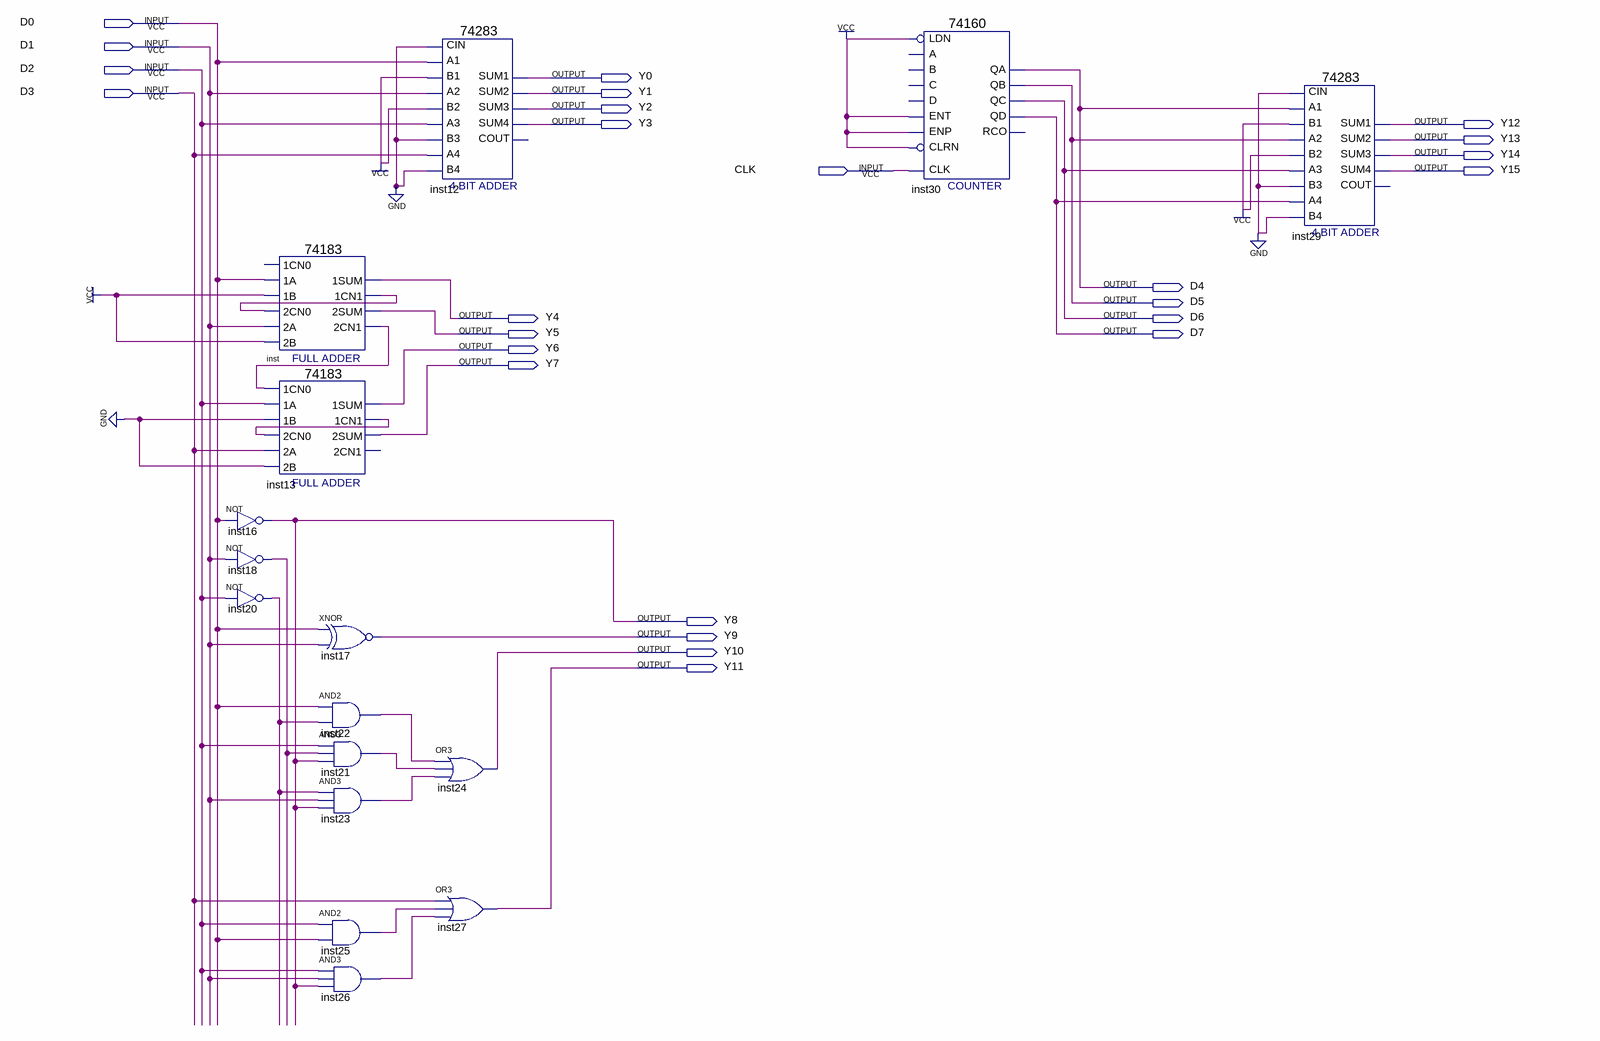
[diagram p0: schematic sheet]
// Quartus schematic lab2.bdf as structural Verilog: 16 symbols, 25 pins
module lab2 (
  input  D0,
  input  D1,
  input  D2,
  input  D3,
  input  CLK,
  output Y0,
  output Y1,
  output Y2,
  output Y3,
  output Y12,
  output Y13,
  output Y14,
  output Y15,
  output D4,
  output D5,
  output Y4,
  output D6,
  output Y5,
  output D7,
  output Y6,
  output Y7,
  output Y8,
  output Y9,
  output Y10,
  output Y11
);

  wire inst13_1cn1, inst18_out, inst20_out, inst21_out, inst22_out, inst23_out, inst25_out, inst26_out,
       inst_1cn1, inst_2cn1;

  not inst16 (Y8, D0);
  not inst18 (inst18_out, D1);
  not inst20 (inst20_out, D2);
  \74183  inst (
    .\2CN0 (inst_1cn1), .\2A (D1), .\1B (1'b1), .\1A (D0), .\2B (1'b1), .\1CN1 (inst_1cn1), .\2SUM (Y5),
    .\2CN1 (inst_2cn1), .\1SUM (Y4));  // open: 1CN0
  \74183  inst13 (
    .\2CN0 (inst13_1cn1), .\2A (D3), .\1B (1'b0), .\1A (D2), .\2B (1'b0), .\1CN0 (inst_2cn1),
    .\1CN1 (inst13_1cn1), .\2SUM (Y7), .\1SUM (Y6));  // open: 2CN1
  xnor inst17 (Y9, D0, D1);
  and inst22 (inst22_out, D0, inst20_out);
  and inst21 (inst21_out, D2, inst18_out, Y8);
  and inst23 (inst23_out, inst20_out, D1, Y8);
  and inst25 (inst25_out, D2, D0);
  and inst26 (inst26_out, D2, D1, Y8);
  \74283  inst12 (
    .CIN(1'b0), .A1(D0), .A2(D1), .B2(1'b1), .A3(D2), .A4(D3), .B4(1'b0), .B1(1'b1), .B3(1'b0), .SUM4(Y3),
    .SUM1(Y0), .SUM2(Y1), .SUM3(Y2));  // open: COUT
  or inst24 (Y10, inst22_out, inst21_out, inst23_out);
  or inst27 (Y11, D3, inst25_out, inst26_out);
  \74160  inst30 (
    .CLK(CLK), .ENT(1'b1), .LDN(1'b1), .ENP(1'b1), .CLRN(1'b1), .QD(D7), .QA(D4), .QB(D5), .QC(D6));  // open: A, B, C, D, RCO
  \74283  inst29 (
    .CIN(1'b0), .A1(D4), .A2(D5), .B2(1'b1), .A3(D6), .A4(D7), .B4(1'b0), .B1(1'b1), .B3(1'b0), .SUM4(Y15),
    .SUM1(Y12), .SUM2(Y13), .SUM3(Y14));  // open: COUT
endmodule
